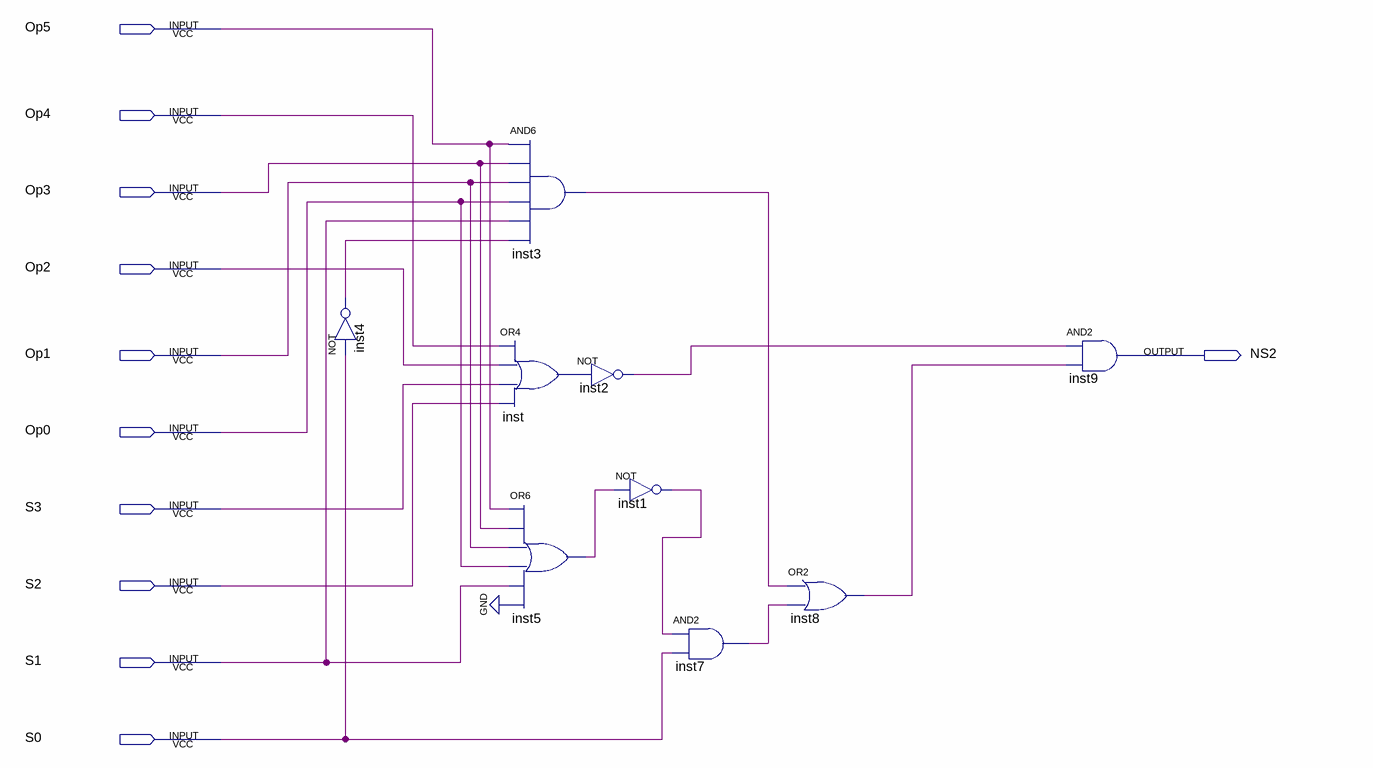
[diagram p0: schematic sheet]
// Quartus schematic NS2.bdf as structural Verilog: 9 symbols, 11 pins
module NS2 (
  input  Op5,
  input  Op4,
  input  Op3,
  input  Op2,
  input  Op1,
  input  Op0,
  input  S3,
  input  S2,
  input  S1,
  input  S0,
  output NS2
);

  wire inst1_out, inst2_out, inst3_out, inst4_out, inst5_out, inst7_out, inst8_out, inst_out;

  not inst4 (inst4_out, S0);
  and inst3 (inst3_out, Op5, Op3, Op1, Op0, S1, inst4_out);
  or inst (inst_out, Op4, Op2, S3, S2);
  or inst5 (inst5_out, Op5, Op3, Op1, Op0, S1, 1'b0);
  not inst2 (inst2_out, inst_out);
  not inst1 (inst1_out, inst5_out);
  and inst7 (inst7_out, inst1_out, S0);
  or inst8 (inst8_out, inst3_out, inst7_out);
  and inst9 (NS2, inst2_out, inst8_out);
endmodule
